# EAGLE schematic flipdot-driver (EAGLE 6.5.0)
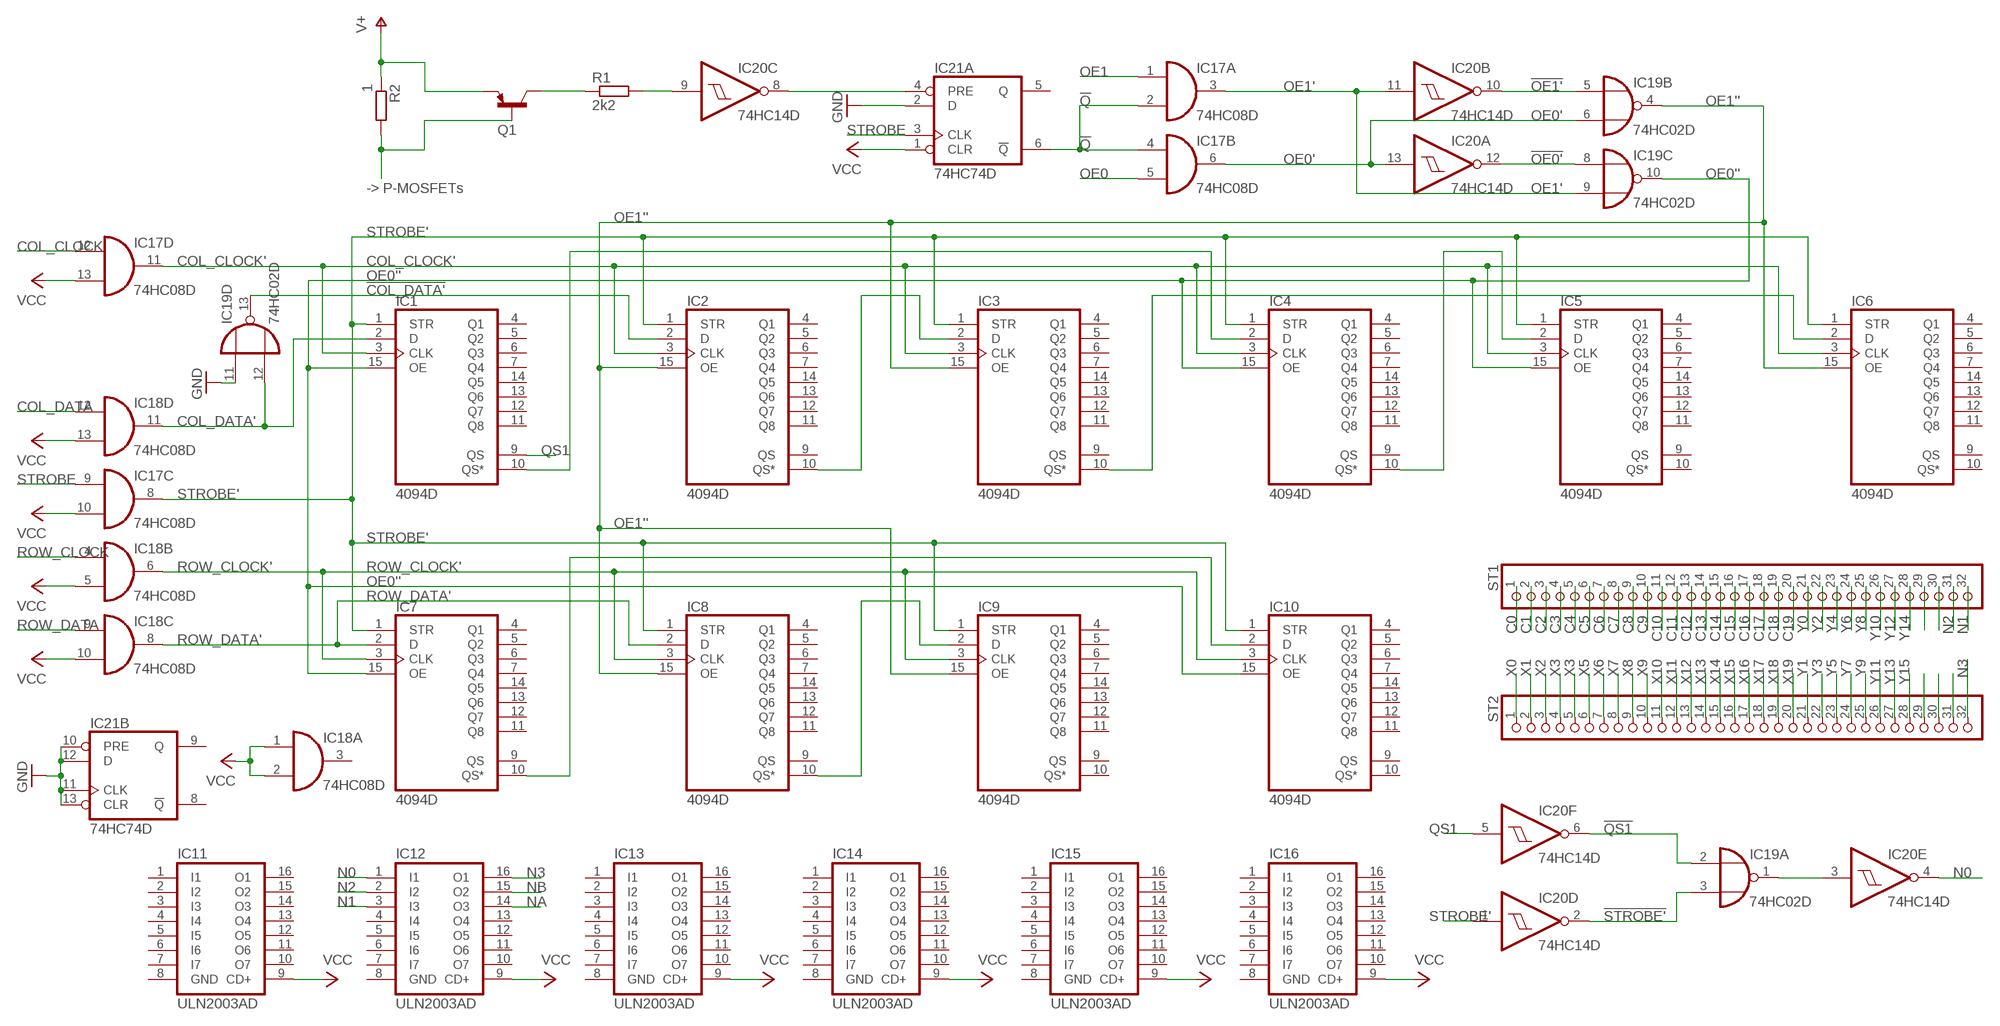
[diagram p0: schematic, sheet 1]

## Parts
IC1  4094D  [SO16]
IC2  4094D  [SO16]
IC3  4094D  [SO16]
IC4  4094D  [SO16]
IC5  4094D  [SO16]
IC6  4094D  [SO16]
IC7  4094D  [SO16]
IC8  4094D  [SO16]
IC9  4094D  [SO16]
IC10  4094D  [SO16]
IC11  ULN2003AD  [SO16]
IC12  ULN2003AD  [SO16]
IC13  ULN2003AD  [SO16]
IC14  ULN2003AD  [SO16]
IC15  ULN2003AD  [SO16]
IC16  ULN2003AD  [SO16]
IC17  74HC08D  [SO14]
IC18  74HC08D  [SO14]
IC19  74HC02D  [SO14]
IC20  74HC14D  [SO14]
IC21  74HC74D  [SO14]
Q1  BC808-25SMD  [SOT23-BEC]
R1  2k2  R-EU_R0603  [R0603]
R2  1  R-EU_R0603  [R0603]
ST1  PINHEAD-1X32  [PINH1X32]
ST2  PINHEAD-1X32  [PINH1X32]

## Nets
!COL_DATA': IC2.2(D) IC19.13(D:O)
!OE0': IC19.8(C:I0) IC20.12(A:O)
!OE1': IC19.5(B:I0) IC20.10(B:O)
!Q: IC17.2(A:I1) IC17.4(B:I0) IC21.6(A:!Q)
!QS1: IC19.2(A:I0) IC20.6(F:O)
!STROBE': IC19.3(A:I1) IC20.2(D:O)
C0: ST1.1
C1: ST1.2
C2: ST1.3
C3: ST1.4
C4: ST1.5
C5: ST1.6
C6: ST1.7
C7: ST1.8
C8: ST1.9
C9: ST1.10
C10: ST1.11
C11: ST1.12
C12: ST1.13
C13: ST1.14
C14: ST1.15
C15: ST1.16
C16: ST1.17
C17: ST1.18
C18: ST1.19
C19: ST1.20
COL_CLOCK: IC17.12(D:I0)
COL_CLOCK': IC1.3(CLK) IC2.3(CLK) IC3.3(CLK) IC4.3(CLK) IC5.3(CLK) IC6.3(CLK) IC17.11(D:O)
COL_DATA: IC18.12(D:I0)
COL_DATA': IC1.2(D) IC18.11(D:O) IC19.12(D:I1)
FOO': IC20.8(C:O) IC21.4(A:PRE)
GND: IC19.11(D:I0) IC21.2(A:D) IC21.10(B:PRE) IC21.11(B:CLK) IC21.12(B:D) IC21.13(B:CLR)
N0: IC12.1(I1) IC20.4(E:O)
N1: IC12.3(I3) ST1.32
N2: IC12.2(I2) ST1.31
N3: IC12.16(O1) ST2.32
N$1: IC7.10(QS*) IC10.2(D)
N$2: Q1.B R2.2
N$3: Q1.C R1.1
N$4: IC8.10(QS*) IC9.2(D)
N$5: IC1.10(QS*) IC4.2(D)
N$6: IC4.10(QS*) IC5.2(D)
N$7: IC2.10(QS*) IC3.2(D)
N$9: IC3.10(QS*) IC6.2(D)
N$11: IC19.1(A:O) IC20.3(E:I)
N$12: IC20.9(C:I) R1.2
N$37: ST1.29
N$38: ST1.30
N$39: ST2.29
N$40: ST2.30
N$41: ST2.31
NA: IC12.14(O3)
NB: IC12.15(O2)
OE0: IC17.5(B:I1)
OE0': IC17.6(B:O) IC19.6(B:I1) IC20.13(A:I)
OE0'': IC1.15(OE) IC4.15(OE) IC5.15(OE) IC7.15(OE) IC10.15(OE) IC19.10(C:O)
OE1: IC17.1(A:I0)
OE1': IC17.3(A:O) IC19.9(C:I1) IC20.11(B:I)
OE1'': IC2.15(OE) IC3.15(OE) IC6.15(OE) IC8.15(OE) IC9.15(OE) IC19.4(B:O)
QS1: IC1.9(QS) IC20.5(F:I)
ROW_CLOCK: IC18.4(B:I0)
ROW_CLOCK': IC7.3(CLK) IC8.3(CLK) IC9.3(CLK) IC10.3(CLK) IC18.6(B:O)
ROW_DATA: IC18.9(C:I0)
ROW_DATA': IC7.2(D) IC8.2(D) IC18.8(C:O)
STROBE: IC17.9(C:I0) IC21.3(A:CLK)
STROBE': IC1.1(STR) IC2.1(STR) IC3.1(STR) IC4.1(STR) IC5.1(STR) IC6.1(STR) IC7.1(STR) IC8.1(STR) IC9.1(STR) IC10.1(STR) IC17.8(C:O) IC20.1(D:I)
V+: Q1.E R2.1
VCC: IC11.9(CD+) IC12.9(CD+) IC13.9(CD+) IC14.9(CD+) IC15.9(CD+) IC16.9(CD+) IC17.10(C:I1) IC17.13(D:I1) IC18.1(A:I0) IC18.2(A:I1) IC18.5(B:I1) IC18.10(C:I1) IC18.13(D:I1) IC21.1(A:CLR)
X0: ST2.1
X1: ST2.2
X2: ST2.3
X3: ST2.4
X4: ST2.5
X5: ST2.6
X6: ST2.7
X7: ST2.8
X8: ST2.9
X9: ST2.10
X10: ST2.11
X11: ST2.12
X12: ST2.13
X13: ST2.14
X14: ST2.15
X15: ST2.16
X16: ST2.17
X17: ST2.18
X18: ST2.19
X19: ST2.20
Y0: ST1.21
Y1: ST2.21
Y2: ST1.22
Y3: ST2.22
Y4: ST1.23
Y5: ST2.23
Y6: ST1.24
Y7: ST2.24
Y8: ST1.25
Y9: ST2.25
Y10: ST1.26
Y11: ST2.26
Y12: ST1.27
Y13: ST2.27
Y14: ST1.28
Y15: ST2.28
Unconnected: IC1.4(Q1) IC1.5(Q2) IC1.6(Q3) IC1.7(Q4) IC1.11(Q8) IC1.12(Q7) IC1.13(Q6) IC1.14(Q5) IC2.4(Q1) IC2.5(Q2) IC2.6(Q3) IC2.7(Q4) IC2.9(QS) IC2.11(Q8) IC2.12(Q7) IC2.13(Q6) IC2.14(Q5) IC3.4(Q1) IC3.5(Q2) IC3.6(Q3) IC3.7(Q4) IC3.9(QS) IC3.11(Q8) IC3.12(Q7) IC3.13(Q6) IC3.14(Q5) IC4.4(Q1) IC4.5(Q2) IC4.6(Q3) IC4.7(Q4) IC4.9(QS) IC4.11(Q8) IC4.12(Q7) IC4.13(Q6) IC4.14(Q5) IC5.4(Q1) IC5.5(Q2) IC5.6(Q3) IC5.7(Q4) IC5.9(QS) IC5.10(QS*) IC5.11(Q8) IC5.12(Q7) IC5.13(Q6) IC5.14(Q5) IC6.4(Q1) IC6.5(Q2) IC6.6(Q3) IC6.7(Q4) IC6.9(QS) IC6.10(QS*) IC6.11(Q8) IC6.12(Q7) IC6.13(Q6) IC6.14(Q5) IC7.4(Q1) IC7.5(Q2) IC7.6(Q3) IC7.7(Q4) IC7.9(QS) IC7.11(Q8) IC7.12(Q7) IC7.13(Q6) IC7.14(Q5) IC8.4(Q1) IC8.5(Q2) IC8.6(Q3) IC8.7(Q4) IC8.9(QS) IC8.11(Q8) IC8.12(Q7) IC8.13(Q6) IC8.14(Q5) IC9.4(Q1) IC9.5(Q2) IC9.6(Q3) IC9.7(Q4) IC9.9(QS) IC9.10(QS*) IC9.11(Q8) IC9.12(Q7) IC9.13(Q6) IC9.14(Q5) IC10.4(Q1) IC10.5(Q2) IC10.6(Q3) IC10.7(Q4) IC10.9(QS) IC10.10(QS*) IC10.11(Q8) IC10.12(Q7) IC10.13(Q6) IC10.14(Q5) IC11.1(I1) IC11.2(I2) IC11.3(I3) IC11.4(I4) IC11.5(I5) IC11.6(I6) IC11.7(I7) IC11.10(O7) IC11.11(O6) IC11.12(O5) IC11.13(O4) IC11.14(O3) IC11.15(O2) IC11.16(O1) IC12.4(I4) IC12.5(I5) IC12.6(I6) IC12.7(I7) IC12.10(O7) IC12.11(O6) IC12.12(O5) IC12.13(O4) IC13.1(I1) IC13.2(I2) IC13.3(I3) IC13.4(I4) IC13.5(I5) IC13.6(I6) IC13.7(I7) IC13.10(O7) IC13.11(O6) IC13.12(O5) IC13.13(O4) IC13.14(O3) IC13.15(O2) IC13.16(O1) IC14.1(I1) IC14.2(I2) IC14.3(I3) IC14.4(I4) IC14.5(I5) IC14.6(I6) IC14.7(I7) IC14.10(O7) IC14.11(O6) IC14.12(O5) IC14.13(O4) IC14.14(O3) IC14.15(O2) IC14.16(O1) IC15.1(I1) IC15.2(I2) IC15.3(I3) IC15.4(I4) IC15.5(I5) IC15.6(I6) IC15.7(I7) IC15.10(O7) IC15.11(O6) IC15.12(O5) IC15.13(O4) IC15.14(O3) IC15.15(O2) IC15.16(O1) IC16.1(I1) IC16.2(I2) IC16.3(I3) IC16.4(I4) IC16.5(I5) IC16.6(I6) IC16.7(I7) IC16.10(O7) IC16.11(O6) IC16.12(O5) IC16.13(O4) IC16.14(O3) IC16.15(O2) IC16.16(O1) IC18.3(A:O) IC21.5(A:Q) IC21.8(B:!Q) IC21.9(B:Q)

## Notes on the sheet
- -> P-MOSFETs

## Power pins joined to a net without a drawn wire
GND: IC11.8(GND) IC12.8(GND) IC13.8(GND) IC14.8(GND) IC15.8(GND) IC16.8(GND) IC17.7(P:GND) IC18.7(P:GND) IC19.7(P:GND) IC20.7(P:GND) IC21.7(P:GND)
VCC: IC17.14(P:VCC) IC18.14(P:VCC) IC19.14(P:VCC) IC20.14(P:VCC) IC21.14(P:VCC)
VDD: IC1.16(VDD) IC2.16(VDD) IC3.16(VDD) IC4.16(VDD) IC5.16(VDD) IC6.16(VDD) IC7.16(VDD) IC8.16(VDD) IC9.16(VDD) IC10.16(VDD)
VSS: IC1.8(VSS) IC2.8(VSS) IC3.8(VSS) IC4.8(VSS) IC5.8(VSS) IC6.8(VSS) IC7.8(VSS) IC8.8(VSS) IC9.8(VSS) IC10.8(VSS)

## Library data of the parts
IC1-IC10 = 40xx:4094: 8-stage SHIFT/STORE REGISTER, tri-state
IC11-IC16 = uln-udn:ULN2003A: DRIVER ARRAY
IC17 IC18 = 74xx-eu:74*08: Quad 2-input AND gate
IC19 = 74xx-eu:74*02: Quad 2-input NOR gate
IC20 = 74xx-eu:74*14: Hex schmitt trigger INVERTER
IC21 = 74xx-eu:74*74: Dual D type positive edge triggered FLIP FLOP, preset and clear
Q1 = transistor-pnp:BC808*: PNP Transistror
R1 R2 = resistor:R-EU_: RESISTOR, European symbol
ST1 ST2 = frell2:PINHEAD-1X32